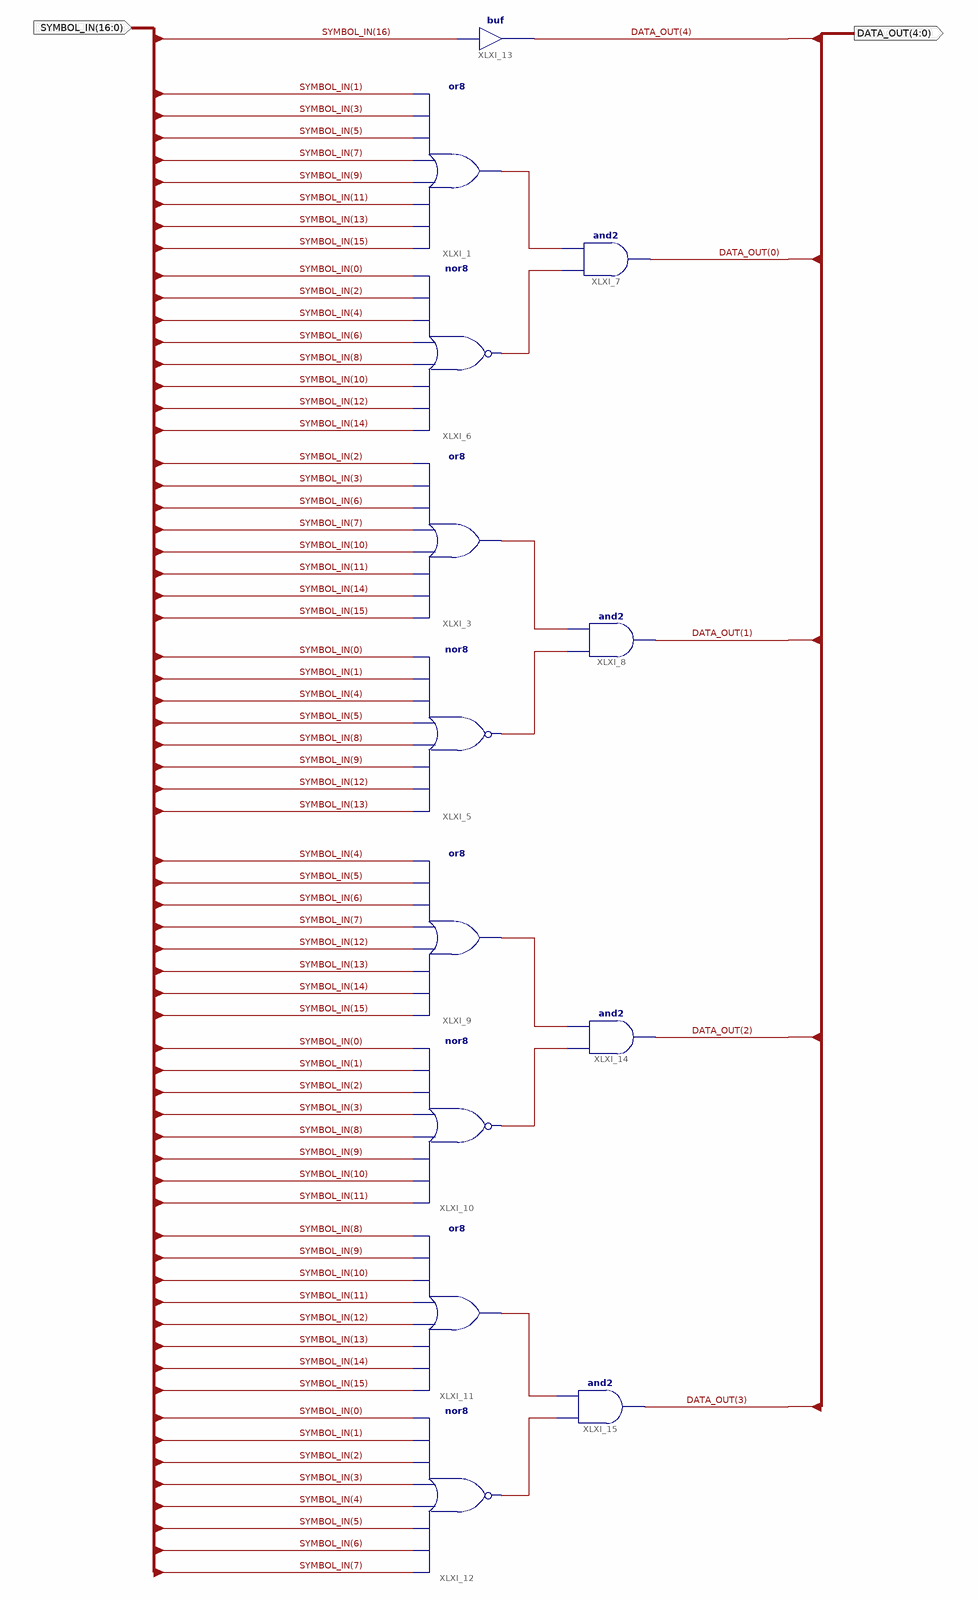
[diagram p0: schematic sheet 1]
// Xilinx ISE schematic Encoder_16_to_4.sch (xbr) as structural Verilog: 13 symbols, 2 ports
module Encoder_16_to_4 (
  input  [16:0] SYMBOL_IN,
  output [4:0] DATA_OUT
);

  wire XLXN_45, XLXN_46, XLXN_47, XLXN_48, XLXN_94, XLXN_95, XLXN_96, XLXN_97;

  or XLXI_1 (XLXN_46, SYMBOL_IN[15], SYMBOL_IN[13], SYMBOL_IN[11], SYMBOL_IN[9], SYMBOL_IN[7], SYMBOL_IN[5], SYMBOL_IN[3], SYMBOL_IN[1]);
  or XLXI_3 (XLXN_47, SYMBOL_IN[15], SYMBOL_IN[14], SYMBOL_IN[11], SYMBOL_IN[10], SYMBOL_IN[7], SYMBOL_IN[6], SYMBOL_IN[3], SYMBOL_IN[2]);
  nor XLXI_5 (XLXN_48, SYMBOL_IN[13], SYMBOL_IN[12], SYMBOL_IN[9], SYMBOL_IN[8], SYMBOL_IN[5], SYMBOL_IN[4], SYMBOL_IN[1], SYMBOL_IN[0]);
  nor XLXI_6 (XLXN_45, SYMBOL_IN[14], SYMBOL_IN[12], SYMBOL_IN[10], SYMBOL_IN[8], SYMBOL_IN[6], SYMBOL_IN[4], SYMBOL_IN[2], SYMBOL_IN[0]);
  and XLXI_7 (DATA_OUT[0], XLXN_45, XLXN_46);
  and XLXI_8 (DATA_OUT[1], XLXN_48, XLXN_47);
  or XLXI_9 (XLXN_97, SYMBOL_IN[15], SYMBOL_IN[14], SYMBOL_IN[13], SYMBOL_IN[12], SYMBOL_IN[7], SYMBOL_IN[6], SYMBOL_IN[5], SYMBOL_IN[4]);
  nor XLXI_10 (XLXN_96, SYMBOL_IN[11], SYMBOL_IN[10], SYMBOL_IN[9], SYMBOL_IN[8], SYMBOL_IN[3], SYMBOL_IN[2], SYMBOL_IN[1], SYMBOL_IN[0]);
  or XLXI_11 (XLXN_95, SYMBOL_IN[15], SYMBOL_IN[14], SYMBOL_IN[13], SYMBOL_IN[12], SYMBOL_IN[11], SYMBOL_IN[10], SYMBOL_IN[9], SYMBOL_IN[8]);
  nor XLXI_12 (XLXN_94, SYMBOL_IN[7], SYMBOL_IN[6], SYMBOL_IN[5], SYMBOL_IN[4], SYMBOL_IN[3], SYMBOL_IN[2], SYMBOL_IN[1], SYMBOL_IN[0]);
  buf XLXI_13 (DATA_OUT[4], SYMBOL_IN[16]);
  and XLXI_14 (DATA_OUT[2], XLXN_96, XLXN_97);
  and XLXI_15 (DATA_OUT[3], XLXN_94, XLXN_95);
endmodule
